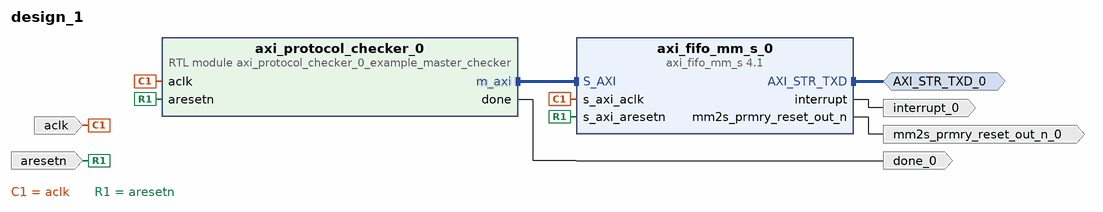
[diagram p0: block diagram of the top level]
# Vivado block design design_1, xc7k70tfbv676-1, Vivado 2018.1
create_bd_design design_1

create_bd_intf_port -mode Master -vlnv xilinx.com:interface:axis_rtl:1.0 AXI_STR_TXD_0
create_bd_port -dir I aresetn
create_bd_port -dir O -type intr interrupt_0
create_bd_port -dir O -type rst mm2s_prmry_reset_out_n_0
create_bd_port -dir O done_0
create_bd_port -dir I -type clk aclk

create_bd_cell -type module -reference axi_protocol_checker_0_example_master_checker axi_protocol_checker_0
create_bd_cell -type ip -vlnv xilinx.com:ip:axi_fifo_mm_s:4.1 axi_fifo_mm_s_0
set_property -dict {CONFIG.C_USE_TX_DATA 1 CONFIG.C_USE_RX_DATA 0 CONFIG.C_USE_TX_CTRL 0} [get_bd_cells axi_fifo_mm_s_0]

# ---- connections ----

connect_bd_intf_net [get_bd_intf_pins axi_protocol_checker_0/m_axi] [get_bd_intf_pins axi_fifo_mm_s_0/S_AXI]
connect_bd_intf_net [get_bd_intf_ports AXI_STR_TXD_0] [get_bd_intf_pins axi_fifo_mm_s_0/AXI_STR_TXD]
connect_bd_net [get_bd_ports aclk] [get_bd_pins axi_protocol_checker_0/aclk] [get_bd_pins axi_fifo_mm_s_0/s_axi_aclk]
connect_bd_net [get_bd_ports aresetn] [get_bd_pins axi_protocol_checker_0/aresetn] [get_bd_pins axi_fifo_mm_s_0/s_axi_aresetn]
connect_bd_net [get_bd_pins axi_fifo_mm_s_0/interrupt] [get_bd_ports interrupt_0]
connect_bd_net [get_bd_pins axi_fifo_mm_s_0/mm2s_prmry_reset_out_n] [get_bd_ports mm2s_prmry_reset_out_n_0]
connect_bd_net [get_bd_pins axi_protocol_checker_0/done] [get_bd_ports done_0]

# ---- address map ----
assign_bd_address -offset 0x44A00000 -range 64K -target_address_space [get_bd_addr_spaces axi_protocol_checker_0/m_axi] [get_bd_addr_segs axi_fifo_mm_s_0/S_AXI/Mem0]

validate_bd_design
save_bd_design
